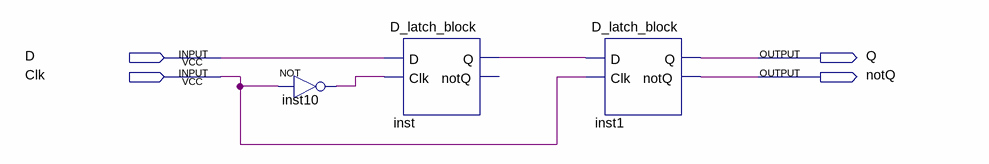
[diagram p0: schematic sheet]
// Quartus schematic Positive_MS_D_latch.bdf as structural Verilog: 3 symbols, 4 pins
module Positive_MS_D_latch (
  input  D,
  input  Clk,
  output Q,
  output notQ
);

  wire inst10_out, inst_q;

  not inst10 (inst10_out, Clk);
  D_latch_block inst (.D(D), .Clk(inst10_out), .Q(inst_q));  // open: notQ
  D_latch_block inst1 (.D(inst_q), .Clk(Clk), .Q(Q), .notQ(notQ));
endmodule
